# Altium schematic sheet Sheet4.SchDoc
size A4
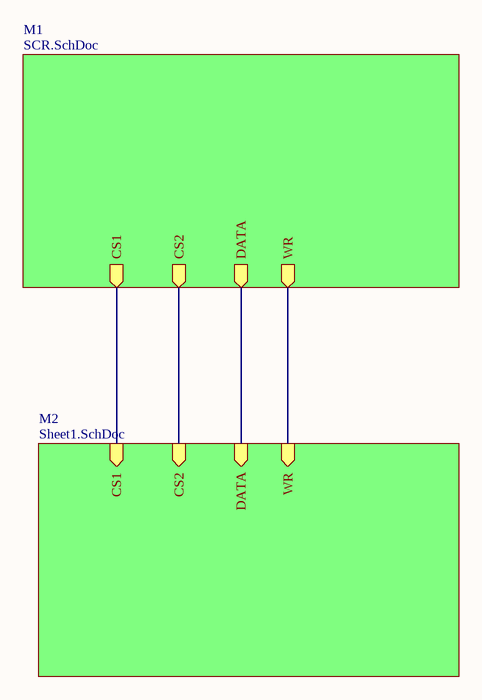
[diagram p0: Sheet4.SchDoc]

## Sub-sheets
M1 = SCR.SchDoc: CS1 (out), CS2 (out), DATA (out), WR (out)
M2 = Sheet1.SchDoc: CS1 (in), CS2 (in), DATA (in), WR (in)

## Nets
(unnamed): sheet M1/CS1, sheet M2/CS1
(unnamed): sheet M1/CS2, sheet M2/CS2
(unnamed): sheet M1/DATA, sheet M2/DATA
(unnamed): sheet M1/WR, sheet M2/WR